# Altium schematic sheet LPCB222 - OVERVIEW.SchDoc
size A3; Address1: Factory 10; Address2: 9-13 Dingley Avenue, Dandeong, VICTORIA 3175, AUSTRALIA; DocumentNumber: 1; Revision: 1; SheetNumber: 1; SheetTotal: 3; Lockie__PCB_SUB_ASSEMBLY: Overview; Lockie__PCB_ASSEMBLY: Gimbal Interface; Lockie__LDL: LPCB222; Lockie__PCB_DESCRIPTION: Gimbal Interface
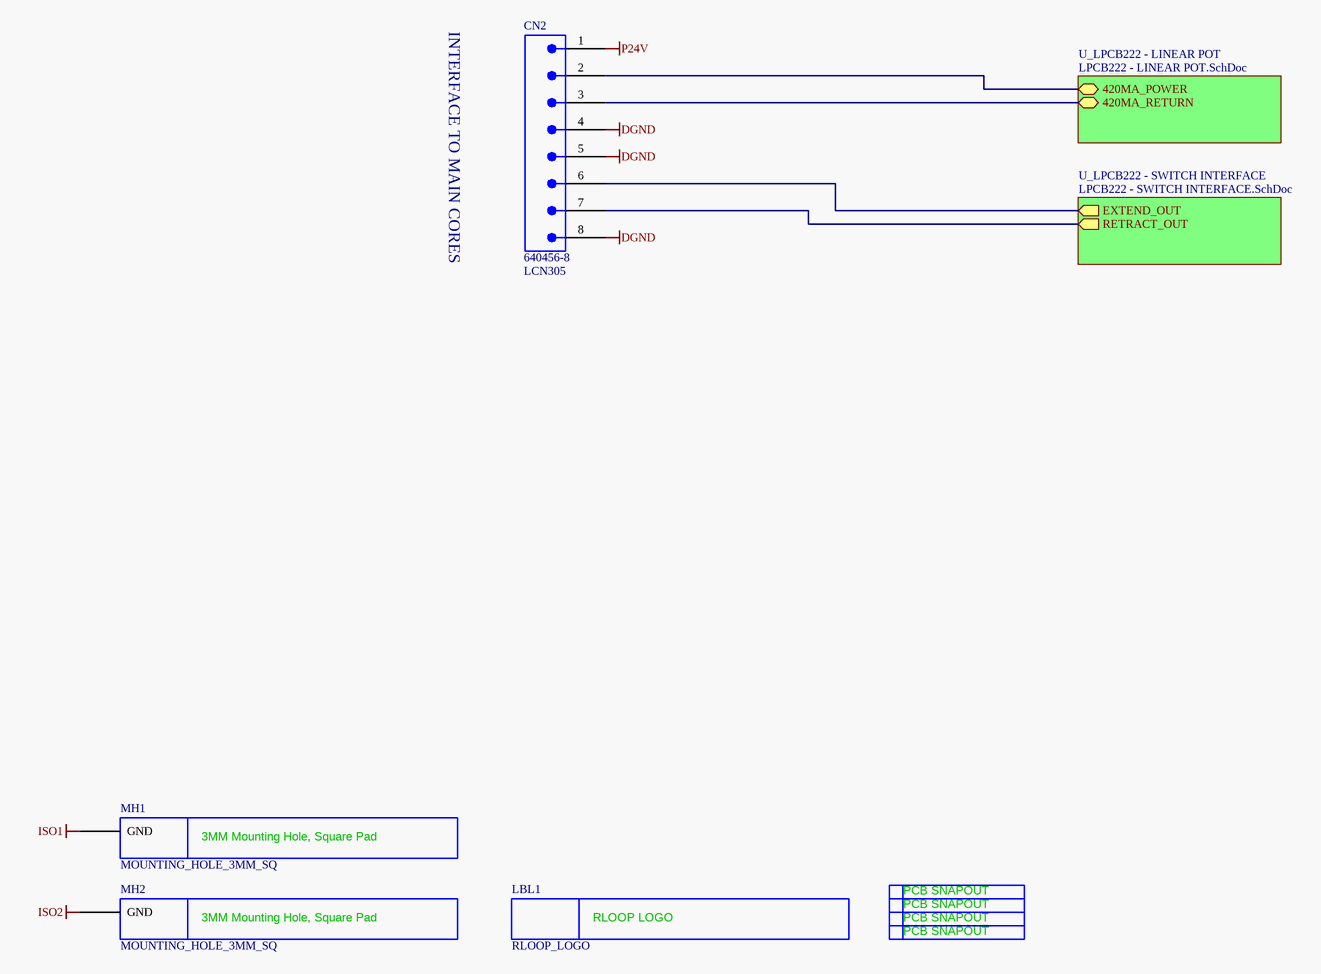
[diagram p0: LPCB222 - OVERVIEW.SchDoc]

## Parts
CN2  640456-8  LDL_NUMBER: LCN305  [640456-8]
LBL1  RLOOP_LOGO  [RLOOP_LOGO]  (no BOM)
MH1  MOUNTING_HOLE_3MM_SQ  [MOUNTING_HOLE_3MM_SQ]  (no BOM)
MH2  MOUNTING_HOLE_3MM_SQ  [MOUNTING_HOLE_3MM_SQ]  (no BOM)
SN1  PCB_SNAPOUT  [SNAPOUT_NEW]  (value not drawn)  (no BOM)
SN2  PCB_SNAPOUT  [SNAPOUT_NEW]  (value not drawn)  (no BOM)
SN3  PCB_SNAPOUT  [SNAPOUT_NEW]  (value not drawn)  (no BOM)
SN4  PCB_SNAPOUT  [SNAPOUT_NEW]  (value not drawn)  (no BOM)

## Sub-sheets
U_LPCB222 - LINEAR POT = LPCB222 - LINEAR POT.SchDoc: 420MA_POWER (bidir), 420MA_RETURN (bidir)
U_LPCB222 - SWITCH INTERFACE = LPCB222 - SWITCH INTERFACE.SchDoc: EXTEND_OUT (out), RETRACT_OUT (out)

## Nets
DGND: CN2.4 CN2.5 CN2.8
ISO1: MH1.MOUNT(GND)
ISO2: MH2.MOUNT(GND)
P24V: CN2.1
NetCN2_2: CN2.2 ; sheet U_LPCB222 - LINEAR POT/420MA_POWER
NetCN2_3: CN2.3 ; sheet U_LPCB222 - LINEAR POT/420MA_RETURN
NetCN2_6: CN2.6 ; sheet U_LPCB222 - SWITCH INTERFACE/EXTEND_OUT
NetCN2_7: CN2.7 ; sheet U_LPCB222 - SWITCH INTERFACE/RETRACT_OUT

## Notes on the sheet
- INTERFACE TO MAIN CORES
- PCB COMPONENT DESCRIPTION
- LDL NUMBER
- Assembly Details
- Size
- Drawing File Name
- Revision
- http://rloop.org
- Scale
- A3
- Sheet Details
- N.T.S
- Sheet:
- Of:
- (in symbol MOUNTING_HOLE_3MM_SQ) 3MM Mounting Hole, Square Pad
- (in symbol PCB_SNAPOUT) PCB SNAPOUT
- (in symbol RLOOP_LOGO) RLOOP LOGO

## Library data of the parts
CN2 = 640456-8: Connector, Male Header, 8 Way; FMEDA__CHANNEL: COM; FMEDA__OPERATING__CURRENT_MAX: 0; FMEDA__OPERATING__TEMP_MAX: 50; FMEDA__OPERATING__TEMP_MIN: -20; FMEDA__OPERATING__TEMP_TYP: 27; FMEDA__OPERATING__VOLTAGE_MAX: 16; FMEDA__OPERATING__VOLTAGE_TYP: 12; FMEDA__FUNCTION_IN_SYSTEM: *; FMEDA__OPERATING__CURRENT_MIN: 0; FMEDA__OPERATING__CURRENT_TYP: 0; FMEDA__OPERATING__VOLTAGE_MIN: 0
LBL1 = RLOOP_LOGO: FMEDA__CHANNEL: DIAG; FMEDA__FUNCTION_IN_SYSTEM: *
MH1 MH2 = MOUNTING_HOLE_3MM_SQ: 3MM Mouting Hole, Square; FMEDA__CHANNEL: DIAG; FMEDA__FUNCTION_IN_SYSTEM: *
SN1-SN4 = PCB_SNAPOUT: FMEDA__CHANNEL: DIAG; FMEDA__FUNCTION_IN_SYSTEM: *